# Altium schematic sheet CAP_MATRIX_OUT.SchDoc
size 149 x 100 mm; SheetNumber: 6; SheetTotal: 6
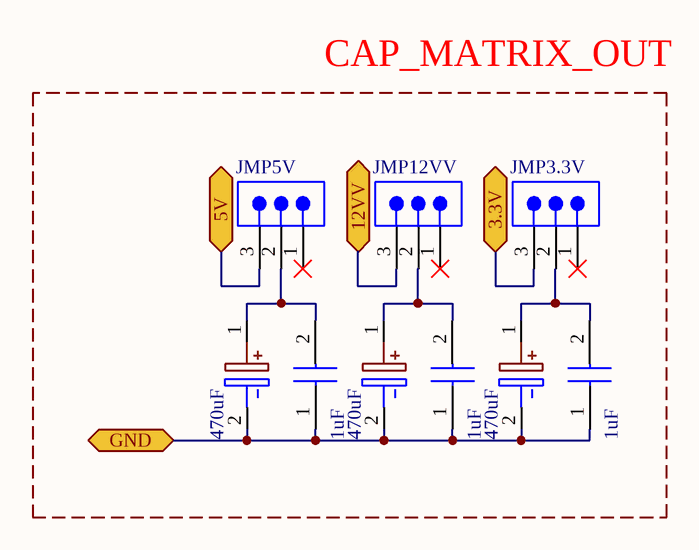
[diagram p0: CAP_MATRIX_OUT.SchDoc]

## Parts
CAPCE5  1uF  [К10-17Б]
CAPCE6  1uF  [К10-17Б]
CAPCE7  1uF  [К10-17Б]
CAPEL5  470uF  [CAP-12.5x13.5]
CAPEL6  470uF  [CAP-12.5x13.5]
CAPEL7  470uF  [CAP-12.5x13.5]
JMP3.3V  JMP-03P  [JMP-03P]  (value not drawn)
JMP5V  JMP-03P  [JMP-03P]  (value not drawn)
JMP12VV  JMP-03P  [JMP-03P]  (value not drawn)

## Blocks framed on the sheet
CAP_MATRIX_OUT: CAPCE5-CAPCE7 CAPEL5-CAPEL7 JMP3.3V JMP5V JMP12VV

## Ports
3.3V (bidir), 5V (bidir), 12VV (bidir), GND (bidir)

## Nets
3.3V: JMP3.3V.3 ; port 3.3V
5V: JMP5V.3 ; port 5V
12VV: JMP12VV.3 ; port 12VV
GND: CAPCE5.1 CAPCE6.1 CAPCE7.1 CAPEL5.2(-) CAPEL6.2(-) CAPEL7.2(-) ; port GND
NetCAPCE5_2: CAPCE5.2 CAPEL5.1(+) JMP5V.2
NetCAPCE6_2: CAPCE6.2 CAPEL6.1(+) JMP12VV.2
NetCAPCE7_2: CAPCE7.2 CAPEL7.1(+) JMP3.3V.2

Not connected (* = marked no-connect by the designer): JMP3.3V 1*; JMP5V 1*; JMP12VV 1*

## Library data of the parts
CAPCE5-CAPCE7 = CAP: К10-17Б
CAPEL5-CAPEL7 = CAP-12.5x13.5: YUQINGXIN
JMP3.3V JMP5V JMP12VV = JMP-03P: PLS-1x3